# Altium schematic sheet Sensor_IO_Buttons_LED.SchDoc
size A3; SheetNumber: 3; SheetTotal: 3
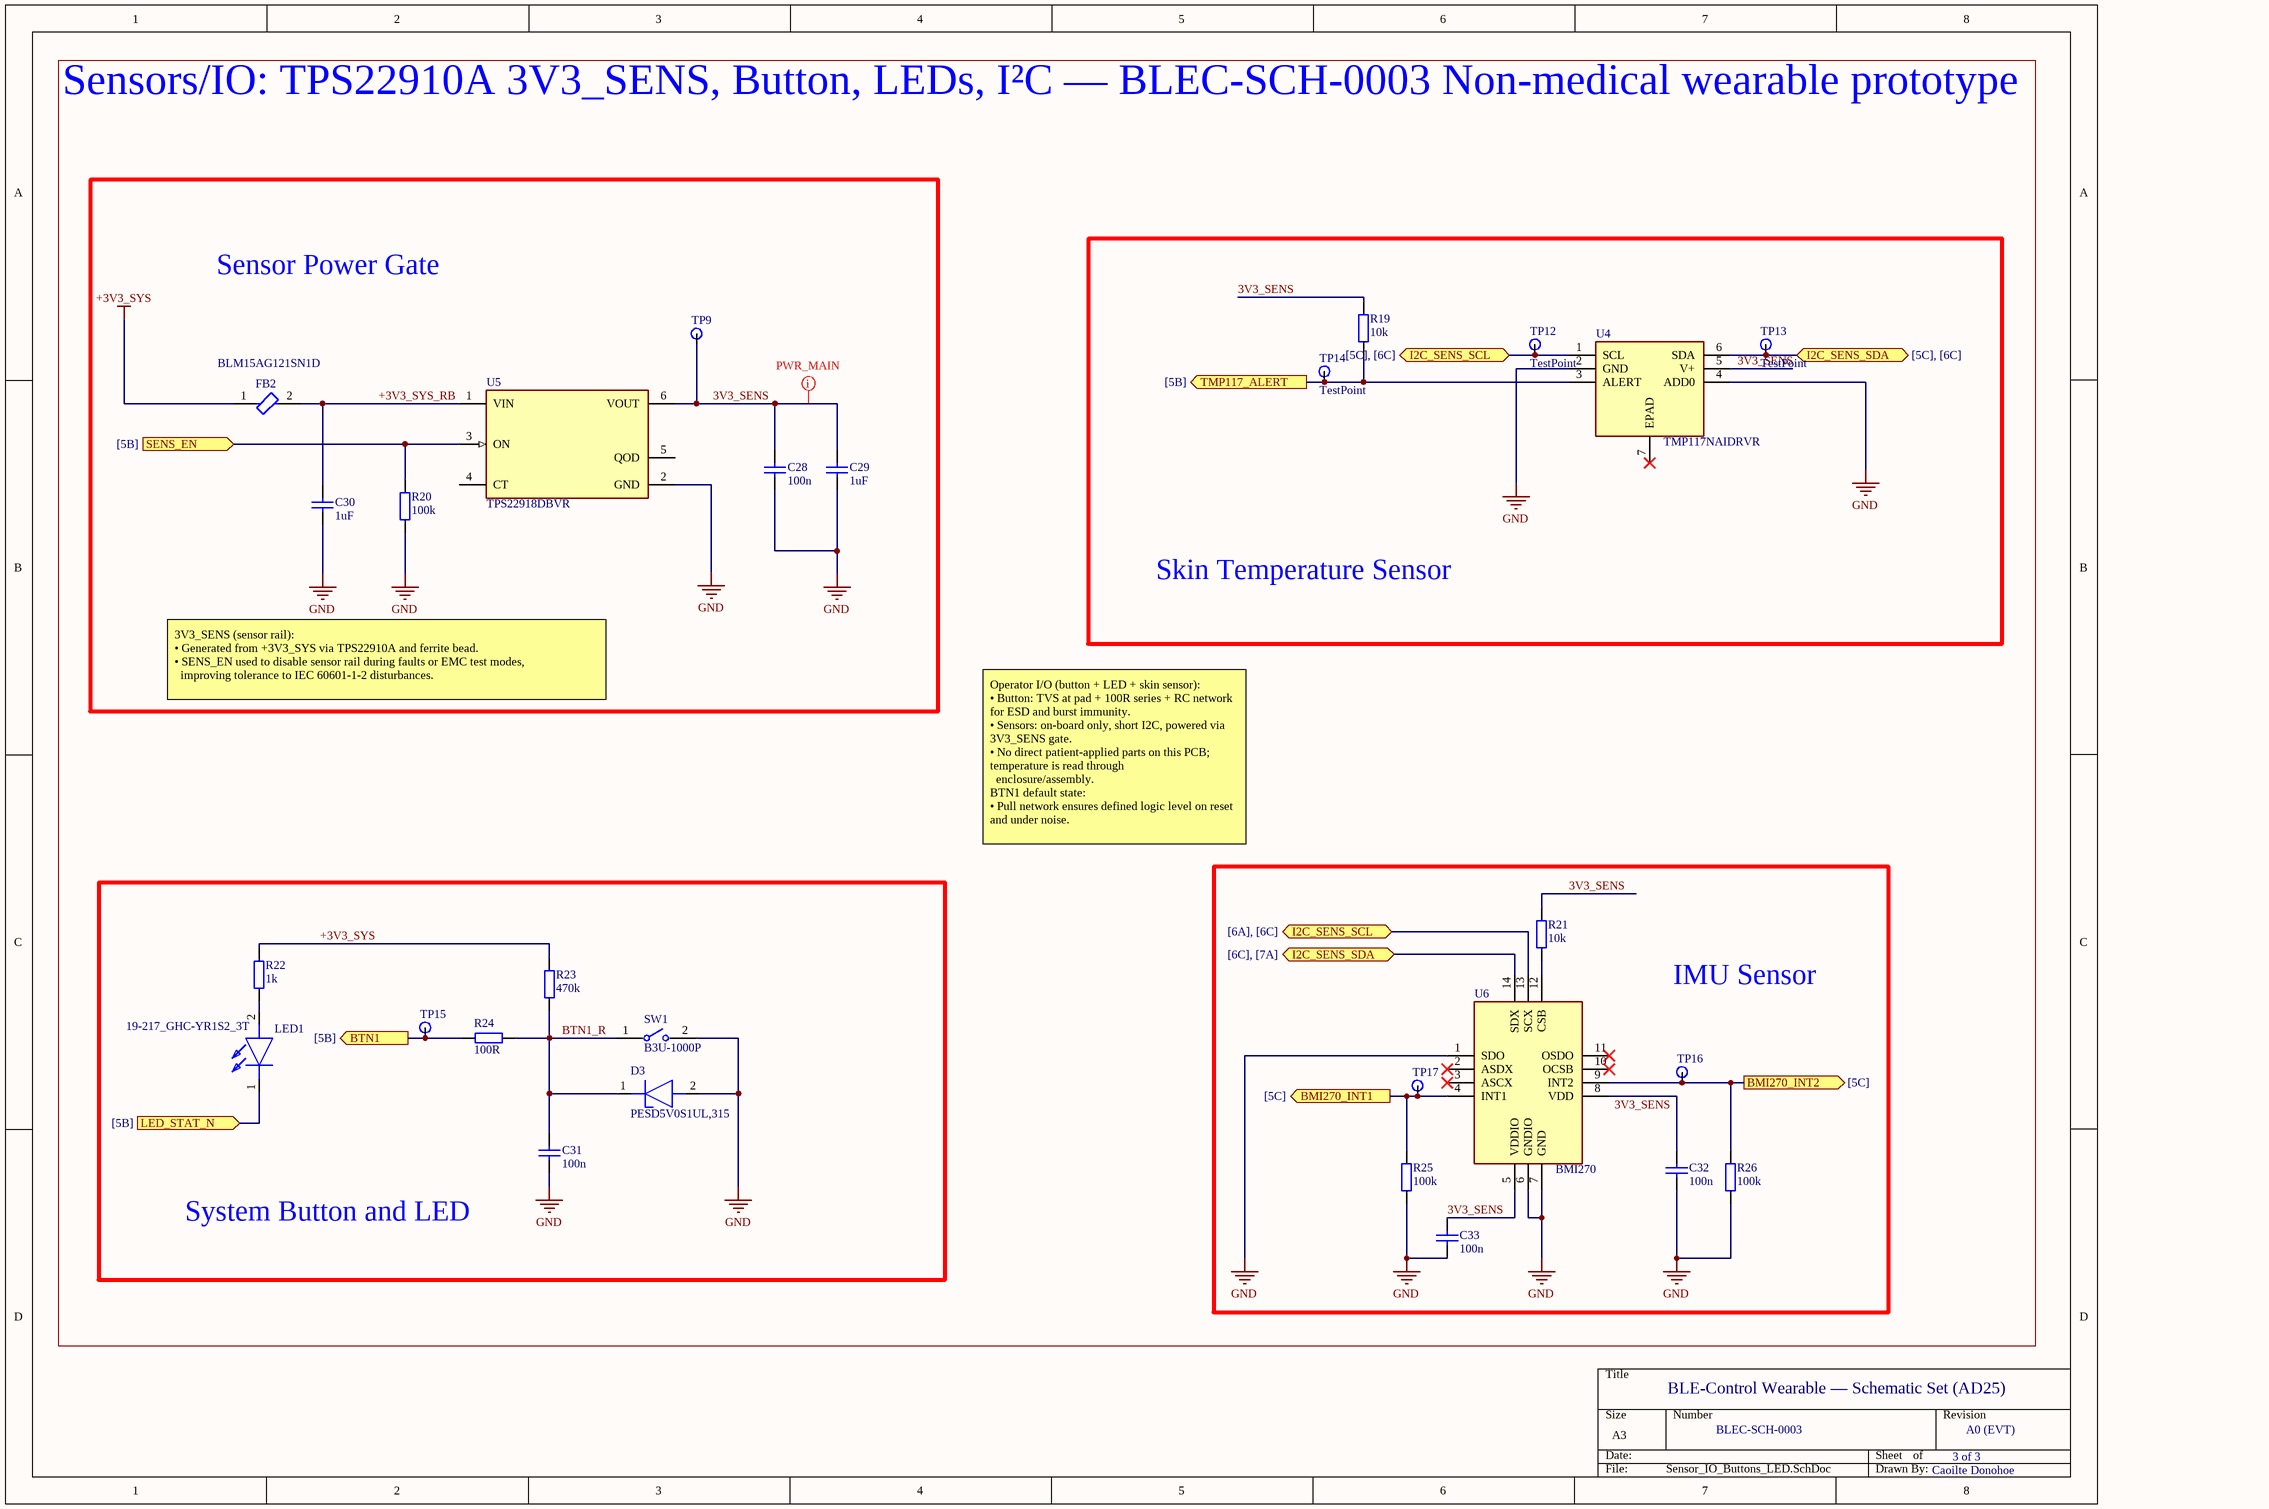
[diagram p0: Sensor_IO_Buttons_LED.SchDoc]

## Parts
C28  100n  [CAP_0402]
C29  1uF  [CAP_0402]
C30  1uF  [CAP_0402]
C31  100n  [CAP_0402]
C32  100n  [CAP_0402]
C33  100n  [CAP_0402]
D3  PESD5V0S1UL,315  [PESD5V0S1BL315]
FB2  BLM15AG121SN1D  [FP-BLM15-0_05-IPC_A]
LED1  19-217_GHC-YR1S2_3T  [LEDC1608X50N]
R19  10k  [RES_0402]
R20  100k  [RES_0402]
R21  10k  [RES_0402]
R22  1k  [RES_0402]
R23  470k  [RES_0402]
R24  100R  [RES_0402]
R25  100k  [RES_0402]
R26  100k  [RES_0402]
SW1  B3U-1000P  [FP-B3U-1000P-MFG]
TP9  (no value)  [TP_VIA_0p75]
TP12  TestPoint  [TP_VIA_0p75]
TP13  TestPoint  [TP_VIA_0p75]
TP14  TestPoint  [TP_VIA_0p75]
TP15  (no value)  [TP_VIA_0p75]
TP16  (no value)  [TP_VIA_0p75]
TP17  (no value)  [TP_VIA_0p75]
U4  TMP117NAIDRVR  [SON65P200X200X80-7N]
U5  TPS22918DBVR  [FP-DBV0006A-IPC_B]
U6  BMI270  [BMI270]

## Blocks framed on the sheet
Sensor Power Gate: C28-C30 FB2 R20 TP9 U5
Skin Temperature Sensor: R19 TP12-TP14 U4
System Button and LED: C31 D3 LED1 R22-R24 SW1 TP15
IMU Sensor: C32 C33 R21 R25 R26 TP16 TP17 U6

## Ports
BMI270_INT1 (out, see [5C]), BMI270_INT2 (out, see [5C]), BTN1 (out, see [5B]), I2C_SENS_SCL (bidir, see [5C], [6C]), I2C_SENS_SCL (bidir, see [6A], [6C]), I2C_SENS_SDA (bidir, see [5C], [6C]), I2C_SENS_SDA (bidir, see [6C], [7A]), LED_STAT_N (in, see [5B]), SENS_EN (in, see [5B]), TMP117_ALERT (out, see [5B])

## Nets
+3V3_SYS: FB2.1 R22.2 R23.2
GND: C28.1 C29.1 C30.1 C31.1 C32.1 C33.1 D3.2(A) R20.1 R25.1 R26.1 SW1.2 U4.2(GND) U4.4(ADD0) U5.2(GND) U6.1(SDO) U6.6(GNDIO) U6.7(GND)
3V3_SENS: C28.2 C29.2 C32.2 C33.2 R19.2 R21.2 TP9.1 U4.5(V+) U5.6(VOUT) U6.5(VDDIO) U6.8(VDD)
+3V3_SYS_RB: C30.2 FB2.2 U5.1(VIN)
BMI270_INT1: R25.2 TP17.1 U6.4(INT1) ; port BMI270_INT1
BMI270_INT2: R26.2 TP16.1 U6.9(INT2) ; port BMI270_INT2
BTN1: R24.2 TP15.1 ; port BTN1
BTN1_R: C31.2 D3.1(K) R23.1 R24.1 SW1.1
I2C_SENS_SCL: TP12.1 U4.1(SCL) U6.13(SCX) ; port I2C_SENS_SCL
I2C_SENS_SDA: TP13.1 U4.6(SDA) U6.14(SDX) ; port I2C_SENS_SDA
LED_STAT_N: LED1.1(K) ; port LED_STAT_N
SENS_EN: R20.2 U5.3(ON) ; port SENS_EN
TMP117_ALERT: R19.1 TP14.1 U4.3(ALERT) ; port TMP117_ALERT
NetLED1_2: LED1.2(A) R22.1
NetR21_1: R21.1 U6.12(CSB)

Not connected (* = marked no-connect by the designer): U4 7(EPAD)*; U5 4(CT) 5(QOD); U6 2(ASDX)* 3(ASCX)* 10(OCSB)* 11(OSDO)*

## Layout directives
net class PWR_MAIN: 3V3_SENS

## Notes on the sheet
- Sensors/IO: TPS22910A 3V3_SENS, Button, LEDs, I²C — BLEC-SCH-0003 Non-medical wearable prototype
- 3V3_SENS (sensor rail):
  • Generated from +3V3_SYS via TPS22910A and ferrite bead.
  • SENS_EN used to disable sensor rail during faults or EMC test modes,
  improving tolerance to IEC 60601-1-2 disturbances.
- Operator I/O (button + LED + skin sensor):
  • Button: TVS at pad + 100R series + RC network for ESD and burst immunity.
  • Sensors: on-board only, short I2C, powered via 3V3_SENS gate.
  • No direct patient-applied parts on this PCB; temperature is read through
  enclosure/assembly.                                       BTN1 default state:
  • Pull network ensures defined logic level on reset and under noise.
- BLE-Control Wearable — Schematic Set (AD25)
- BLEC-SCH-0003
- 3 of 3
- A0 (EVT)
- Caoilte Donohoe

## Library data of the parts
C28 C31-C33 = C_0402: Ceramic Chip Capacitor 0402; Voltage: 10V; Dielectric: X7R; Tolerance: 10%; ProductionStatus: Placeholder; Package: 0402 (1005); Height: 0.35mm
C29 C30 = C_0402: Ceramic Chip Capacitor 0402; PartNumber: C1005X5R1E105K; Voltage: 10V; Dielectric: X7R; Tolerance: 10%; ProductionStatus: Placeholder; Package: 0402 (1005); Height: 0.35mm; Part Number: C1005X5R1E105K
D3 = PESD5V0S1UL,315: Diode ESD (Uni-directional); Manufacturer_Name: Nexperia; Datasheet Link: https://assets.nexperia.com/documents/data-sheet/PESD5V0S1UL.pdf; Height: 0mm; Manufacturer_Part_Number: PESD5V0S1UL,315; Mouser Part Number: 771-PESD5V0S1UL315; Mouser Price/Stock: https://www.mouser.co.uk/ProductDetail/Nexperia/PESD5V0S1UL315?qs=LOCUfHb8d9sSC%2FUB7ugsVw%3D%3D; Arrow Part Number: PESD5V0S1UL,315; Arrow Price/Stock: https://www.arrow.com/en/products/pesd5v0s1ul315/nexperia?utm_currency=USD&region=nac
FB2 = CMP-0686-00170-4: Chip Ferrite Bead, 0402, 120Ω @ 100MHz, 0.19Ω, 25%, 550mA; Material: Steel; Max DC Current: 500mA; Shielding: Unshielded; Number of Lines: 1; DC Resistance (DCR): 190mR; Impedance: 120R; Packaging: Tape and Reel; Core Material: Ferrite; Number of Pins: 2; Tolerance: 25%; Case Code (Imperial): 0402; DC Current: 500mA; Termination: SMD/SMT; Height: 0.5mm; REACH SVHC: No SVHC; Max Operating Temperature: 125°C; Case Code (Metric): 1005; Length: 1mm; Test Frequency: 100MHz; Lead Free: Lead Free; Depth: 0.55mm; Max Current Rating: 550mA; Case/Package: 0402; Min Operating Temperature: -55°C; Width: 0.5mm; Military Standard: Not; Frequency: 100MHz; Current Rating: 550mA; Package Quantity: 1; Number of Circuits: 1; Radiation Hardening: No
LED1 = 19-217_GHC-YR1S2_3T: LED; Manufacturer_Name: Everlight; Manufacturer_Part_Number: 19-217/GHC-YR1S2/3T; Datasheet Link: https://www.mouser.co.uk/datasheet/2/143/19-217-GHC-YR1S2-3T-1663276.pdf; Height: 0.5mm; Mouser Part Number: 638-19217GHCYR1S23T; Mouser Price/Stock: https://www.mouser.co.uk/ProductDetail/Everlight/19-217-GHC-YR1S2-3T?qs=8cKuZ6Ok2lZjmFTUzVFjDg%3D%3D; Arrow Part Number: 19-217/GHC-YR1S2/3T; Arrow Price/Stock: https://www.arrow.com/en/products/19-217ghc-yr1s23t/everlight-electronics
R19-R26 = R_0402: Resistor SMD 0402; Manufacturer: *; Manufacturer Part Number: *; Distributor Link: *; LCSC: *
SW1 = Omron B3U-1000P_Switch: SWITCH TACTILE SPST-NO 0.05A 12V; Contact Resistance: 100mR; Operating Force: 1.5N; Max Current Rating: 50mA; Switch Travel: 0.15mm; Actuator Type: Standard; Mechanical Life: 200000Cycles; Ratings: Dust Proof; Illumination Type: Non-Illuminated; Throw Configuration: SPST; Actuator Length: 0.4mm; Switch Function: Off-Mom; Height: 1.2mm; Width: 3mm; Weight: 0.000776oz; Contact Material: Silver; Max Voltage Rating (DC): 12V; Insulation Resistance: 100MR; Lead Free: Lead Free; Current Rating: 50mA; Termination: SMD/SMT; Length: 4mm; Voltage Rating (DC): 12V; Contact Current Rating: 50mA; Orientation: Straight; Depth: 2.5mm; Max Operating Temperature: 70°C; Packaging: Tape and Reel; Min Operating Temperature: -25°C; Package Quantity: 1; Mount: Surface Mount; Electrical Life: 200000Cycles
TP9 TP15-TP17 = TestPoint
U4 = TMP117NAIDRVR: Integrated Circuit; Manufacturer_Name: Texas Instruments; Datasheet Link: http://www.ti.com/lit/gpn/tmp117; Height: 0.8mm; Manufacturer_Part_Number: TMP117NAIDRVR; Mouser Part Number: 595-TMP117NAIDRVR; Mouser Price/Stock: https://www.mouser.co.uk/ProductDetail/Texas-Instruments/TMP117NAIDRVR?qs=qSfuJ%252Bfl%2Fd51FgClPJTgfg%3D%3D; Arrow Part Number: TMP117NAIDRVR; Arrow Price/Stock: https://www.arrow.com/en/products/tmp117naidrvr/texas-instruments?utm_currency=USD&region=nac
U5 = TPS22918DBVR: IC SINGLE CHANNEL LOAD SWITCH; NexarPartId: 71360943; Manufacturer Lifecycle Status: ACTIVE; Fall Time: 2µs; Max Junction Temperature (Tj): 125°C; Number of Channels: 1; Output Current: 2A; Max Supply Voltage: 5.5V; Output Configuration: High Side; Min Supply Voltage: 1V; Interface: On/Off; Rise Time: 2.54ms; Turn-On Delay Time: 1.95ms; Lead Free: Lead Free; RoHS: Compliant; Ambient Temperature Range High: 105°C; Thickness: 1.2mm; Width: 1.6mm; Lifecycle Status: Production; Case/Package: SOT-23; Schedule B: 8542390000, 8542390000|8542390000|8542390000|8542390000|8542390000|8542390000|8542390000|8542390000|8542390000|8542390000|8542390000|8542390000|8542390000|8542390000|8542390000|8542390000|8542390000|8542390000|8542390000|8542390000|8542390000|8542390000|8542390000|85; Turn-Off Delay Time: 2µs; Max Output Current: 2A; Number of Outputs: 1; Number of Pins: 6; Height: 1.45mm; Number of Drivers: 1; Length: 2.9mm; Max Operating Temperature: 105°C; Min Operating Temperature: -40°C
U6 = BMI270: Integrated Circuit; Manufacturer_Name: BOSCH; Datasheet Link: https://www.bosch-sensortec.com/media/boschsensortec/downloads/datasheets/bst-bmi270-ds000.pdf; Height: 0.87mm; Manufacturer_Part_Number: BMI270; Mouser Part Number: 262-BMI270; Mouser Price/Stock: https://www.mouser.co.uk/ProductDetail/Bosch-Sensortec/BMI270?qs=u16ybLDytRYIj%252BjQEee88A%3D%3D; Arrow Part Number: BMI270; Arrow Price/Stock: https://www.arrow.com/en/products/bmi270/bosch-sensortec?utm_currency=USD&region=nac